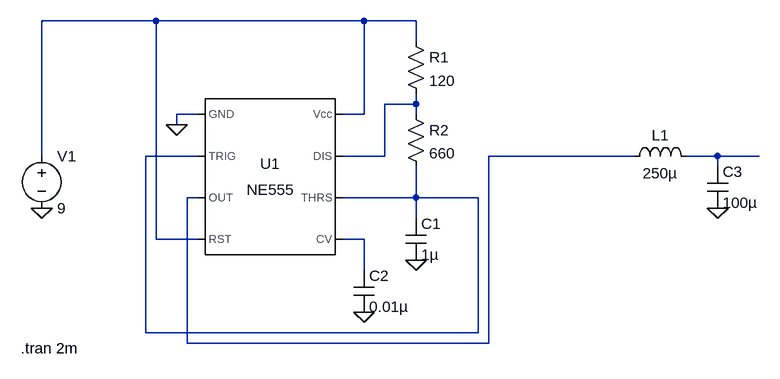
[diagram p0: schematic metalDetector.asc]
metalDetector.asc, the LTspice schematic file:
Version 4
SHEET 1 1168 680
WIRE 0 -48 -176 -48
WIRE 320 -48 0 -48
WIRE 400 -48 320 -48
WIRE 400 -16 400 -48
WIRE 400 80 400 64
WIRE 400 80 352 80
WIRE 64 96 32 96
WIRE 320 96 320 -48
WIRE 320 96 288 96
WIRE 400 96 400 80
WIRE 32 112 32 96
WIRE -176 160 -176 -48
WIRE 64 160 -16 160
WIRE 352 160 352 80
WIRE 352 160 288 160
WIRE 736 160 512 160
WIRE 864 160 816 160
WIRE 928 160 864 160
WIRE 864 176 864 160
WIRE 64 224 48 224
WIRE 400 224 400 176
WIRE 400 224 288 224
WIRE 496 224 400 224
WIRE 400 256 400 224
WIRE 0 288 0 -48
WIRE 64 288 0 288
WIRE 320 288 288 288
WIRE 320 336 320 288
WIRE -16 432 -16 160
WIRE 496 432 496 224
WIRE 496 432 -16 432
WIRE 48 448 48 224
WIRE 512 448 512 160
WIRE 512 448 48 448
FLAG 32 112 0
FLAG 320 400 0
FLAG 400 320 0
FLAG -176 240 0
FLAG 864 240 0
SYMBOL Misc\\NE555 176 192 R0
SYMATTR InstName U1
SYMBOL res 384 -32 R0
SYMATTR InstName R1
SYMATTR Value 120
SYMBOL res 384 80 R0
SYMATTR InstName R2
SYMATTR Value 660
SYMBOL cap 384 256 R0
SYMATTR InstName C1
SYMATTR Value 1µ
SYMBOL cap 304 336 R0
SYMATTR InstName C2
SYMATTR Value 0.01µ
SYMBOL voltage -176 144 R0
WINDOW 123 0 0 Left 0
WINDOW 39 0 0 Left 0
SYMATTR InstName V1
SYMATTR Value 9
SYMBOL ind 720 176 R270
WINDOW 0 32 56 VTop 2
WINDOW 3 5 56 VBottom 2
SYMATTR InstName L1
SYMATTR Value 250µ
SYMBOL cap 848 176 R0
SYMATTR InstName C3
SYMATTR Value 100µ
TEXT -208 456 Left 2 !.tran 2m

The netlist it stands for:
* metalDetector.asc
XU1 0 N003 N004 N001 N006 N003 N002 N001 NE555  ; pins GND TRIG OUT RST CV THRS DIS Vcc
R1 N001 N002 120
R2 N002 N003 660
C1 N003 0 1µ
C2 N006 0 0.01µ
V1 N001 0 9
L1 N004 N005 250µ
C3 N005 0 100µ
.tran 2m
.lib NE555.sub
.backanno
.end